# EAGLE design schalterbox_01 (EAGLE 5.12)
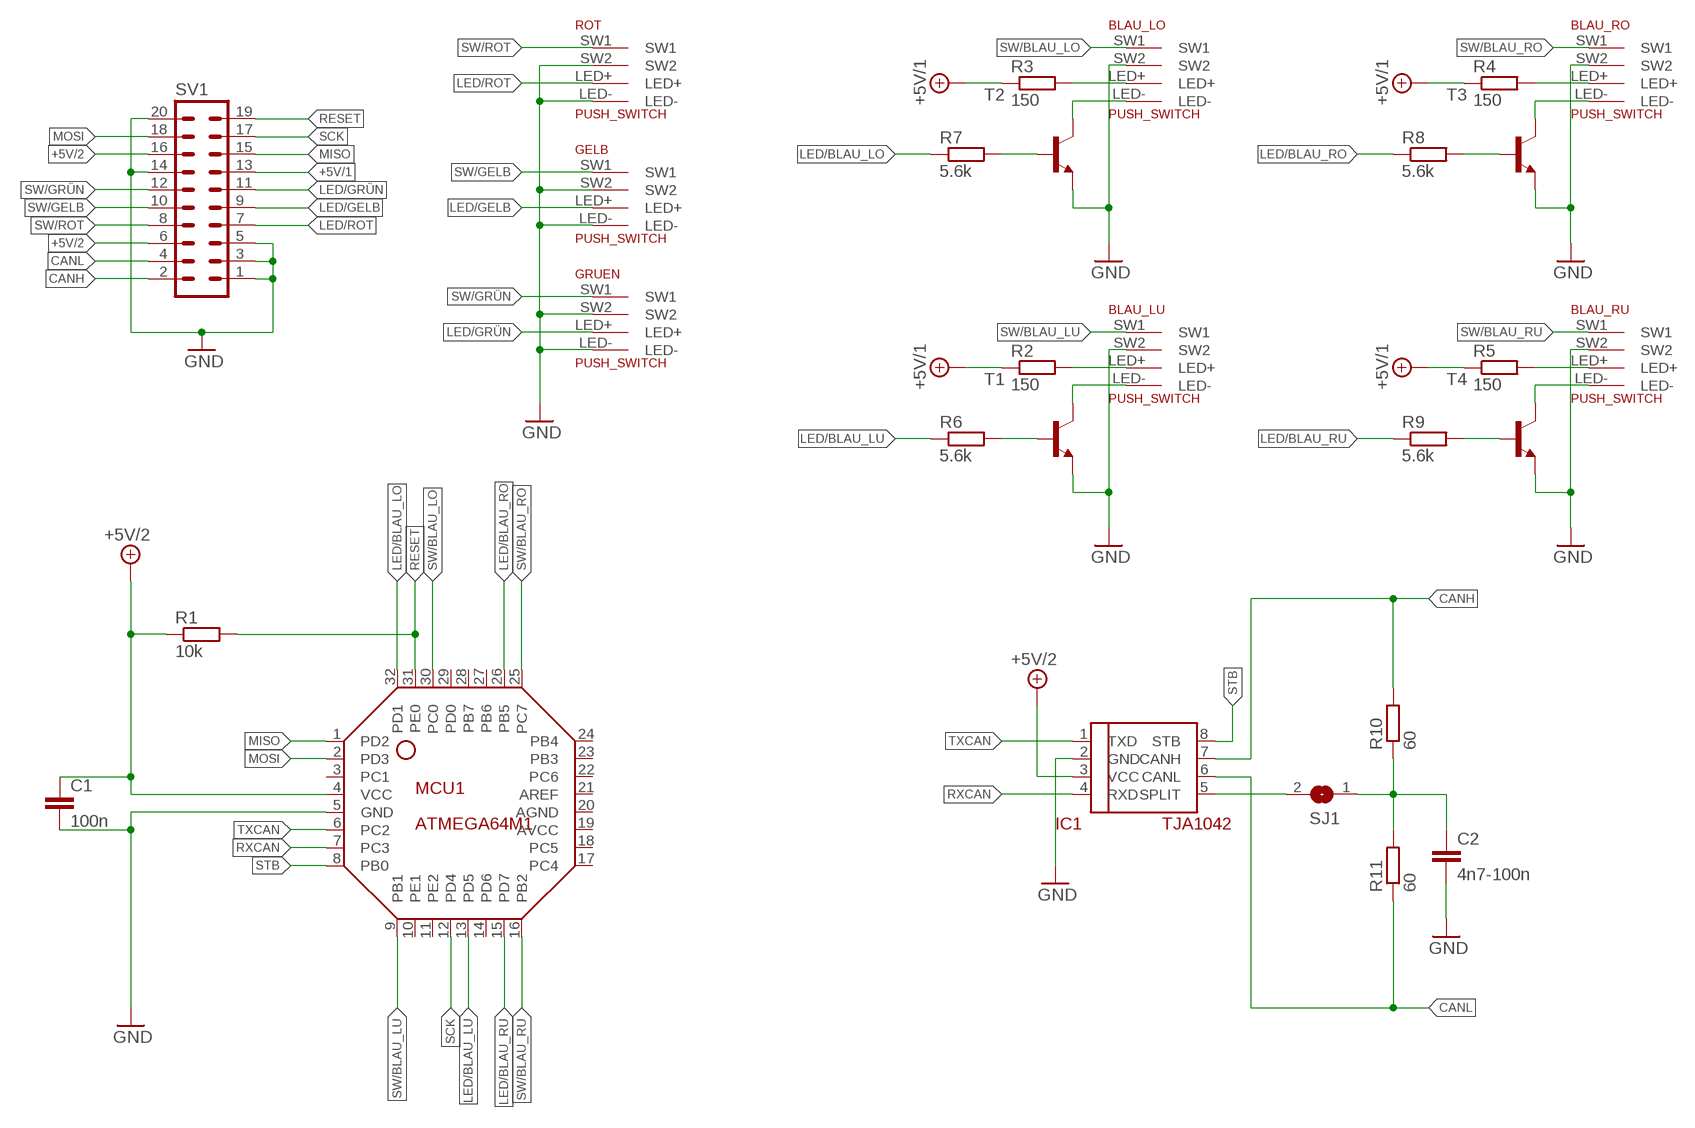
[diagram p0: schematic, sheet 1]

## Parts
BLAU_LO  PUSH_SWITCH  [PUSH_SWITCH]
BLAU_LU  PUSH_SWITCH  [PUSH_SWITCH]
BLAU_RO  PUSH_SWITCH  [PUSH_SWITCH]
BLAU_RU  PUSH_SWITCH  [PUSH_SWITCH]
C1  100n  C-EUC0603  [C0603]
C2  4n7-100n  C-EUC0603  [C0603]
GELB  PUSH_SWITCH  [PUSH_SWITCH]
GRUEN  PUSH_SWITCH  [PUSH_SWITCH]
IC1  TJA1042  [SO08]
MCU1  ATMEGA64M1  [TQFP-32]
R1  10k  R-EU_R0805  [R0805]
R2  150  R-EU_R0805  [R0805]
R3  150  R-EU_R0805  [R0805]
R4  150  R-EU_R0805  [R0805]
R5  150  R-EU_R0805  [R0805]
R6  5.6k  R-EU_R0805  [R0805]
R7  5.6k  R-EU_R0805  [R0805]
R8  5.6k  R-EU_R0805  [R0805]
R9  5.6k  R-EU_R0805  [R0805]
R10  60  R-EU_R0805  [R0805]
R11  60  R-EU_R0805  [R0805]
ROT  PUSH_SWITCH  [PUSH_SWITCH]
SJ1  SJ  [SJ]
SV1  ML20L  [ML20L]
T1  BC817-40-NPN-SOT23-BEC  [SOT23-BEC]
T2  BC817-40-NPN-SOT23-BEC  [SOT23-BEC]
T3  BC817-40-NPN-SOT23-BEC  [SOT23-BEC]
T4  BC817-40-NPN-SOT23-BEC  [SOT23-BEC]

## Nets
+5V/1: R2.1 R3.1 R4.1 R5.1 SV1.13
+5V/2: C1.1 IC1.3(VCC) MCU1.4(VCC) R1.1 SV1.6 SV1.16
CANH: IC1.7(CANH) R10.2 SV1.2
CANL: IC1.6(CANL) R11.1 SV1.4
GND: BLAU_LO.SW2 BLAU_LU.SW2 BLAU_RO.SW2 BLAU_RU.SW2 C1.2 C2.2 GELB.LED- GELB.SW2 GRUEN.LED- GRUEN.SW2 IC1.2(GND) MCU1.5(GND) ROT.LED- ROT.SW2 SV1.1 SV1.3 SV1.5 SV1.14 SV1.20 T1.E T2.E T3.E T4.E
LED/BLAU_LO: MCU1.32(PD1) R7.1
LED/BLAU_LU: MCU1.13(PD5) R6.1
LED/BLAU_RO: MCU1.26(PB5) R8.1
LED/BLAU_RU: MCU1.15(PD7) R9.1
LED/GELB: GELB.LED+ SV1.9
LED/GRÜN: GRUEN.LED+ SV1.11
LED/ROT: ROT.LED+ SV1.7
MISO: MCU1.1(PD2) SV1.15
MOSI: MCU1.2(PD3) SV1.18
N$1: C2.1 R10.1 R11.2 SJ1.1
N$2: IC1.5(SPLIT) SJ1.2
N$3: BLAU_LO.LED+ R3.2
N$4: BLAU_LO.LED- T2.C
N$7: BLAU_LU.LED+ R2.2
N$8: BLAU_LU.LED- T1.C
N$11: BLAU_RU.LED+ R5.2
N$13: BLAU_RU.LED- T4.C
N$17: BLAU_RO.LED+ R4.2
N$18: BLAU_RO.LED- T3.C
N$22: R6.2 T1.B
N$23: R9.2 T4.B
N$24: R8.2 T3.B
N$25: R7.2 T2.B
RESET: MCU1.31(PE0) R1.2 SV1.19
RXCAN: IC1.4(RXD) MCU1.7(PC3)
SCK: MCU1.12(PD4) SV1.17
STB: IC1.8(STB) MCU1.8(PB0)
SW/BLAU_LO: BLAU_LO.SW1 MCU1.30(PC0)
SW/BLAU_LU: BLAU_LU.SW1 MCU1.9(PB1)
SW/BLAU_RO: BLAU_RO.SW1 MCU1.25(PC7)
SW/BLAU_RU: BLAU_RU.SW1 MCU1.16(PB2)
SW/GELB: GELB.SW1 SV1.10
SW/GRÜN: GRUEN.SW1 SV1.12
SW/ROT: ROT.SW1 SV1.8
TXCAN: IC1.1(TXD) MCU1.6(PC2)
Unconnected: MCU1.3(PC1) MCU1.10(PE1) MCU1.11(PE2) MCU1.14(PD6) MCU1.17(PC4) MCU1.18(PC5) MCU1.19(AVCC) MCU1.20(AGND) MCU1.21(AREF) MCU1.22(PC6) MCU1.23(PB3) MCU1.24(PB4) MCU1.27(PB6) MCU1.28(PB7) MCU1.29(PD0)

## Library data of the parts
BLAU_LO BLAU_LU BLAU_RO BLAU_RU GELB GRUEN ROT = ownParts:PUSH_SWITCH
C1 C2 = rcl:C-EU: CAPACITOR, European symbol
IC1 = ownParts:TJA1042
MCU1 = ownParts:ATMEGA64M1
R1-R11 = resistor:R-EU_: RESISTOR, European symbol
SJ1 = jumper:SJ: SMD solder JUMPER
SV1 = con-ml:ML20L: HARTING; OC_FARNELL: unknown; OC_NEWARK: unknown
T1-T4 = transistor:*-NPN-: NPN Transistror BF959 corrected 2008.03.06

## Board
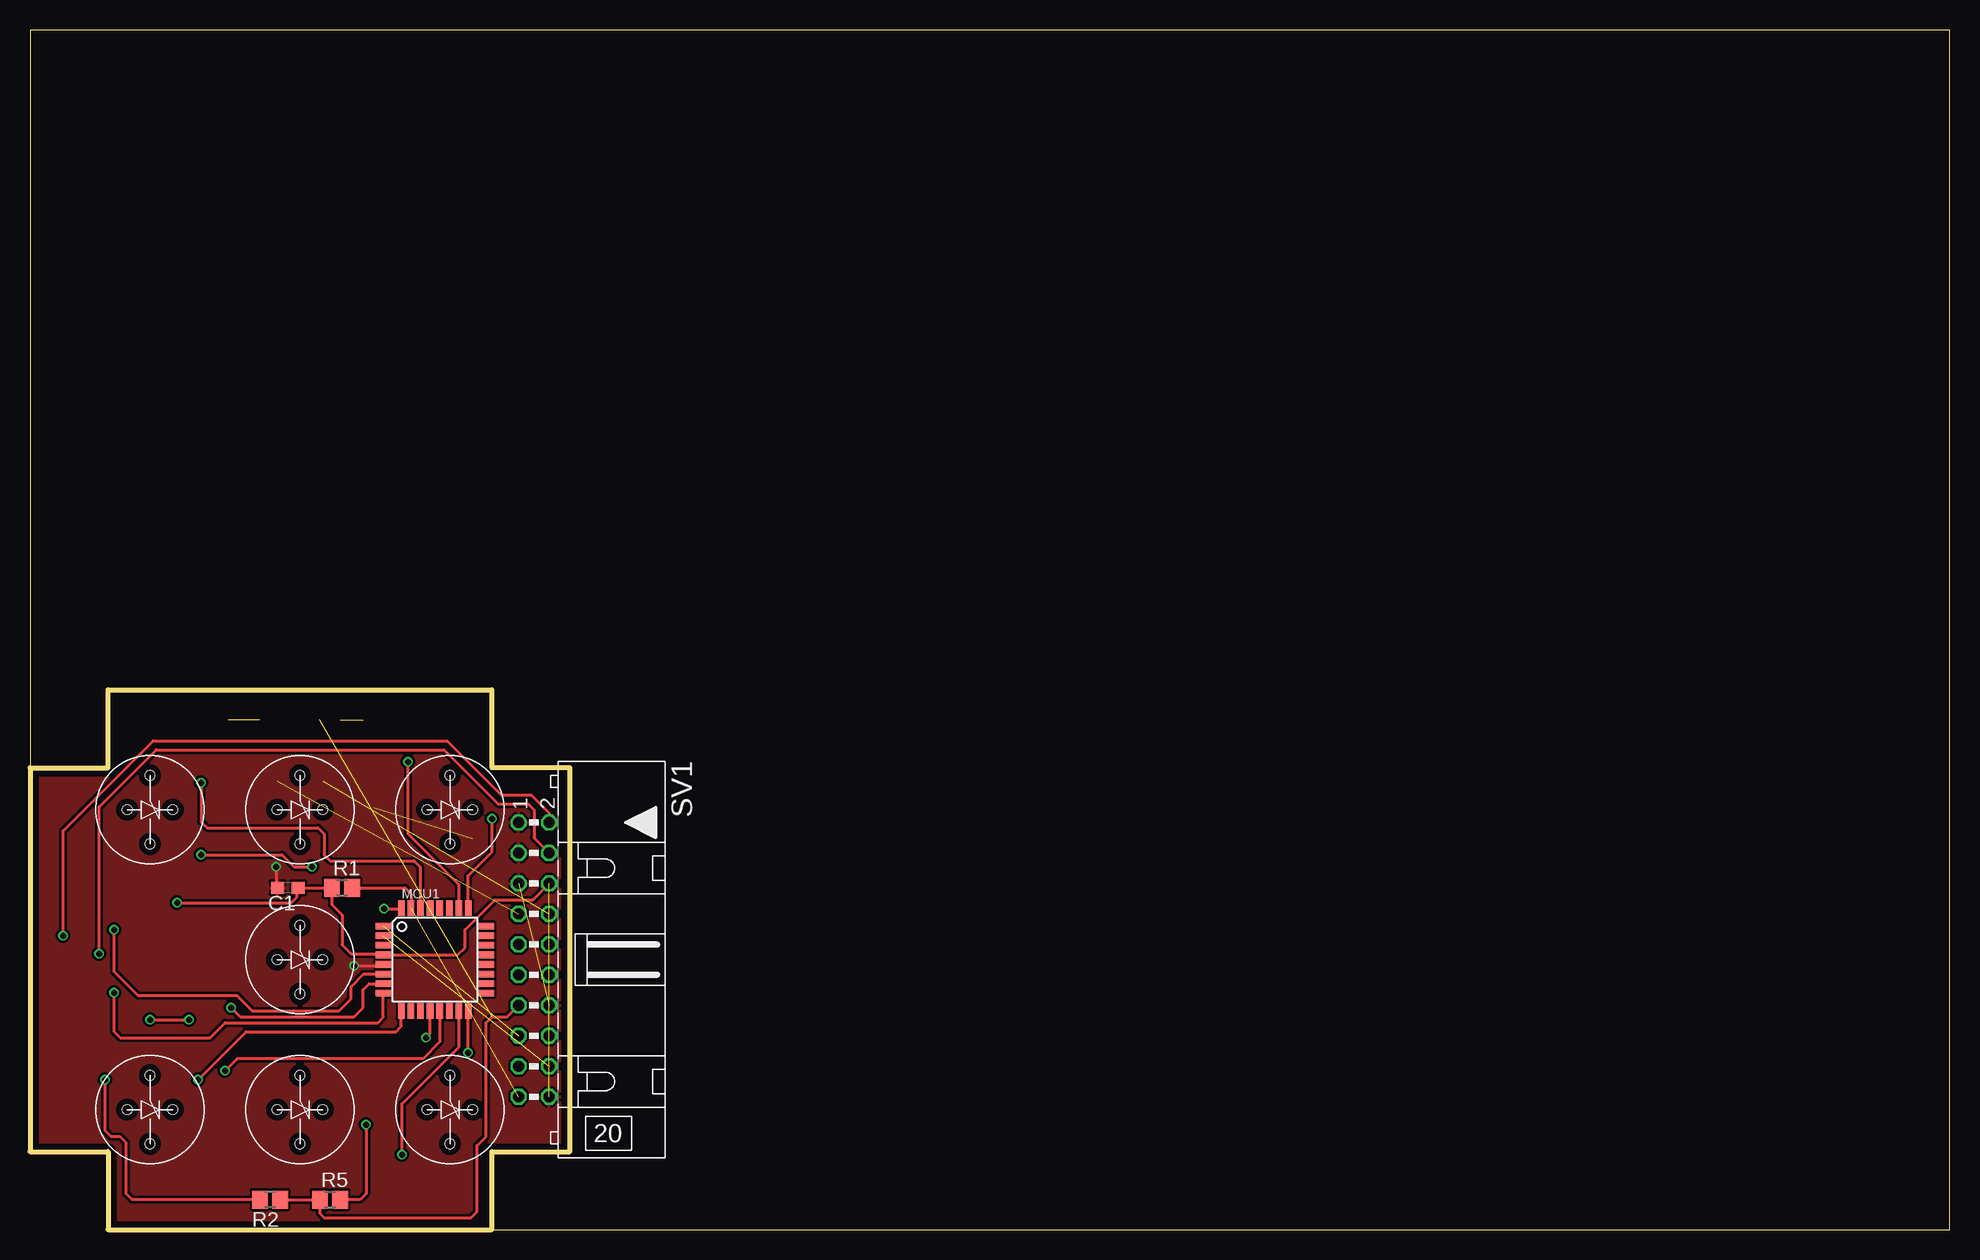
[diagram p1: board, top side]
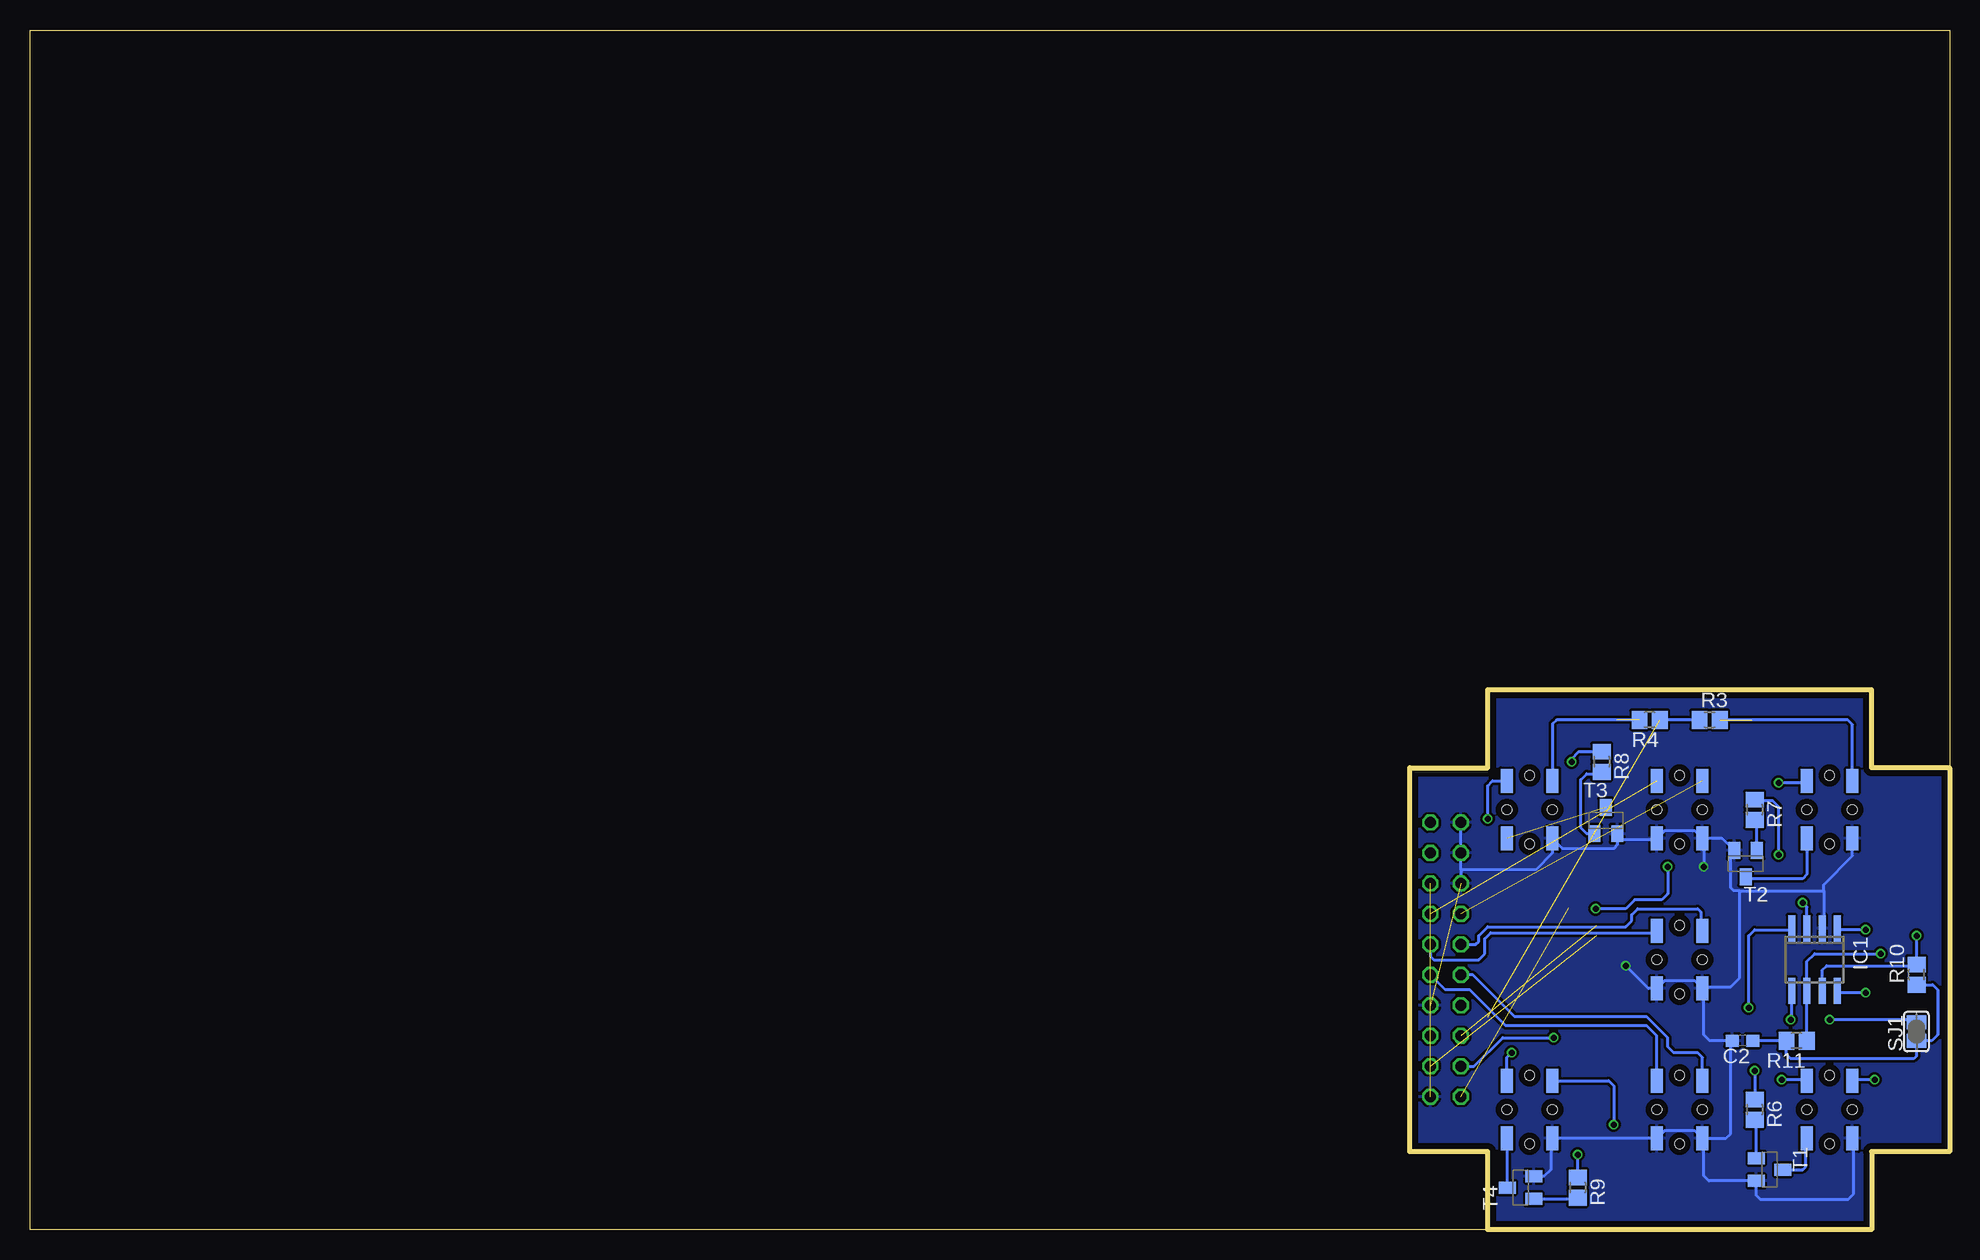
[diagram p2: board, bottom side, seen from below]

Size 160 x 100 mm. Coordinates in mm from the lower left corner, seen from the top.
Outline: 38.5,0 160,0 160,100 0,100 0,38.5
Outline: 0,38.5 0,6.5 6.5,6.5 6.5,0 38.5,0
Outline: 0,38.5 6.5,38.5 6.5,45 38.5,45 38.5,38.5 45,38.5 45,6.5 38.5,6.5 38.5,0
Copper layers (1*16): Top 0.07mm / dielectric 1.5mm / Bottom 0.07mm
Design rules "multi-cb_070um-cu": minimum track width 8mil, minimum drill 12mil, track to track 8mil, track to pad 8mil, pad to pad 8mil, via to via 8mil, smd to smd 8mil, copper to edge 20mil, drill to drill 8mil, minimum pad ring 8mil, minimum via ring 6mil, stop-mask expansion 3mil, vias tented up to drill 0mil, thermal gap 8mil

### Footprints (pad centres in the part's own frame; a part is rotated, then mirrored left to right if it is on the bottom)
PUSH_SWITCH = smd 1 x 2 bottom: LED+ -1.9,2.4; LED- 1.9,-2.4; SW1 1.9,2.4; SW2 -1.9,-2.4 | hole 0.8: 0,2.85; 0,-2.85; -1.9,0; 1.9,0
C0603 = smd 1.1 x 1: 1 -0.85,0; 2 0.85,0
SO08 = smd 0.6 x 2.2: 1 -1.905,-2.6; 2 -0.635,-2.6; 3 0.635,-2.6; 4 1.905,-2.6; 5 1.905,2.6; 6 0.635,2.6; 7 -0.635,2.6; 8 -1.905,2.6
TQFP-32 = smd 1.27 x 0.559: 1 -4.293,2.8; 2 -4.293,2; 3 -4.293,1.2; 4 -4.293,0.4; 5 -4.293,-0.4; 6 -4.293,-1.2; 7 -4.293,-2; 8 -4.293,-2.8; 17 4.293,-2.8; 18 4.293,-2; 19 4.293,-1.2; 20 4.293,-0.4; 21 4.293,0.4; 22 4.293,1.2; 23 4.293,2; 24 4.293,2.8 | smd 0.559 x 1.27: 9 -2.8,-4.293; 10 -2,-4.293; 11 -1.2,-4.293; 12 -0.4,-4.293; 13 0.4,-4.293; 14 1.2,-4.293; 15 2,-4.293; 16 2.8,-4.293; 25 2.8,4.293; 26 2,4.293; 27 1.2,4.293; 28 0.4,4.293; 29 -0.4,4.293; 30 -1.2,4.293; 31 -2,4.293; 32 -2.8,4.293
R0805 = smd 1.3 x 1.5: 1 -0.85,0; 2 0.85,0
SJ = smd 1.168 x 1.6: 1 -0.762,0; 2 0.762,0
ML20L = drill 0.914 octagon: 1 -11.43,-1.27; 2 -11.43,1.27; 3 -8.89,-1.27; 4 -8.89,1.27; 5 -6.35,-1.27; 6 -6.35,1.27; 7 -3.81,-1.27; 8 -3.81,1.27; 9 -1.27,-1.27; 10 -1.27,1.27; 11 1.27,-1.27; 12 1.27,1.27; 13 3.81,-1.27; 14 3.81,1.27; 15 6.35,-1.27; 16 6.35,1.27; 17 8.89,-1.27; 18 8.89,1.27; 19 11.43,-1.27; 20 11.43,1.27
SOT23-BEC = smd 1 x 1.4: B -0.95,-1.1; C 0,1.1; E 0.95,-1.1

### Placement (x,y rotation side)
BLAU_LO  10,35 0 top
BLAU_LU  10,10 0 top
BLAU_RO  35,35 0 top
BLAU_RU  35,10 0 top
C1  21.5,28.5 180 top
C2  17.25,15.75 180 bottom
GELB  22.5,22.5 0 top
GRUEN  22.5,10 0 top
IC1  11.25,22.5 180 bottom
MCU1  33.75,22.5 0 top
R1  26,28.5 0 top
R2  20,2.5 180 top
R3  20,42.5 0 bottom
R4  25,42.5 180 bottom
R5  25,2.5 0 top
R6  16.25,10 270 bottom
R7  16.25,35 270 bottom
R8  29,39 270 bottom
R9  31,3.5 270 bottom
R10  2.75,21.25 90 bottom
R11  12.75,15.75 180 bottom
ROT  22.5,35 0 top
SJ1  2.75,16.5 90 bottom
SV1  42,22.5 270 top
T1  15,5 270 bottom
T2  17,30.5 180 bottom
T3  28.65,34.1 0 bottom
T4  35.75,3.5 90 bottom

### Tracks (layer width: path | path; a pad name or v marks a point on that pad's centre or on a via)
+5V/1  (1 unrouted)
  Top 0.254: R2.1 R5.1 24.15,1.35 24.5,1 36.75,1 37.25,1.5 37.25,7 38,7.75 38,17.25 38.5,17.75 39.79,17.75 SV1.13
  Bottom 0.254: R3.1 R4.1
+5V/2  (via drill 0.5)  (1 unrouted)
  Top 0.254: v12.25,27.25 21.75,27.25 22.25,27.75 22.25,28.4 C1.1 R1.1 25.15,27.1 26,26.25 26,23.75 26.75,23 29.36,23 MCU1.4 35.65,22.9 36.25,23.5 36.25,25 38.75,27.5 41.92,27.5 SV1.6
  Bottom 0.254: IC1.3 11.88,26.89 v12.25,27.25
CANH  (via drill 0.5)
  Top 0.254: SV1.2 43.27,34.73 41.75,36.25 39.25,36.25 34.75,40.75 10.25,40.75 2.75,33.25 v2.75,24.5
  Bottom 0.254: v2.75,24.5 R10.2 2.85,22 10.25,22 10.62,21.64 IC1.7
CANL  (via drill 0.5)
  Top 0.254: v5.75,23 5.75,35.25 10.5,40 34.5,40 39,35.5 41.5,35.5 42,35 42,32.66 SV1.4
  Bottom 0.254: R11.1 11.9,19.89 IC1.6 11.88,22.36 11.25,23 v5.75,23
GND  (via drill 0.5)  (2 unrouted)
  Top 0.254: v20.5,30.25 20.5,28.65 C1.2 | MCU1.5 29.36,22 v27,22
  Bottom 0.254: BLAU_LO.SW2 8.1,31.15 10.5,28.75 10.5,28.25 | 10.5,28.25 10.5,25.21 IC1.2 | T4.E 33.8,4.45 33.25,5 33.25,7.45 BLAU_RU.SW2 GRUEN.LED- 23.75,8.25 21.25,8.25 GRUEN.SW2 | GRUEN.SW2 20.5,7.5 20.5,4.5 20.05,4.05 T1.E 16.1,2.85 15.75,2.5 8.5,2.5 8,3 8,7.5 BLAU_LU.SW2 | GELB.SW2 21.25,20.75 23.75,20.75 GELB.LED- 25.1,20.1 v27,22 | ROT.SW2 21.25,33.25 23.75,33.25 ROT.LED- 24.5,32.5 27.7,32.5 T3.E 27.7,32.05 28,31.75 32.25,31.75 BLAU_RO.SW2 33.1,31.4 34.5,30 40.73,30 | ROT.SW2 18.95,32.6 T2.E 18.25,31.3 18.25,28.5 18,28.25 17.5,28.25 | GRUEN.SW2 18.65,7.6 18.25,8 18.25,15.6 C2.2 20,15.75 20.5,16.25 20.5,20 GELB.SW2 | ROT.SW2 20.5,32.5 v20.5,30.25 | GELB.SW2 20.45,20.25 18.25,20.25 17.5,21 17.5,28.25 | 17.5,28.25 10.5,28.25 | SV1.1 SV1.3 40.73,30 | 40.73,30 SV1.5
  pour Top: 0,45 45,45 45,0 0,0
  pour Bottom: 0,45 45,45 45,0 0,0
LED/BLAU_LO  (via drill 0.5)
  Top 0.254: MCU1.32 30.91,26.75 v29.5,26.75 | v23.5,30.25 22,30.25 21,31.25 v14.25,31.25
  Bottom 0.254: v29.5,26.75 27,26.75 26.25,27.5 24,27.5 23.5,28 v23.5,30.25 | v14.25,31.25 14.25,35.25 14.75,35.75 16.15,35.75 R7.1
LED/BLAU_LU  (via drill 0.5)
  Top 0.254: MCU1.13 34.15,15.65 32.75,14.25 17.25,14.25 v16.25,13.25
  Bottom 0.254: v16.25,13.25 R6.1
LED/BLAU_RO  (via drill 0.5)
  Top 0.254: v31.5,39 31.5,33 35.75,28.75 MCU1.26
  Bottom 0.254: R8.1 30.9,39.85 31.5,39.25 v31.5,39
LED/BLAU_RU  (via drill 0.5)
  Top 0.254: v31,6.25 31,10.5 35.75,15.25 MCU1.15
  Bottom 0.254: R9.1 v31,6.25
LED/GELB
  Bottom 0.254: SV1.9 39.48,23.77 39.25,24 39.25,24.5 38.5,25.25 27,25.25 26.5,25.75 26.5,26.25 26,26.75 21,26.75 20.75,26.5 20.75,25.05 GELB.LED+
LED/GRÜN
  Bottom 0.254: GRUEN.LED+ 20.6,14.35 21,14.75 23,14.75 23.5,15.25 23.5,16 25.25,17.75 36.25,17.75 39.75,21.25 40.71,21.25 SV1.11
LED/ROT  (1 unrouted)
MISO  (1 unrouted)
MOSI  (1 unrouted)
N$1
  Bottom 0.254: C2.1 R11.2 13.6,14.6 13.25,14.25 3,14.25 2.75,14.5 SJ1.1 2.74,15.75 1.5,15.75 1,16.25 1,20 1.4,20.4 R10.1
N$2  (via drill 0.5)
  Top 0.254: v10,17.5 v13.25,17.5
  Bottom 0.254: SJ1.2 2.99,17.5 v10,17.5 | v13.25,17.5 13.15,17.59 IC1.5
N$3  (2 unrouted)
  Bottom 0.254: BLAU_LO.LED+ 8.1,42.1 8.5,42.5 R3.2
N$4
  Bottom 0.254: BLAU_LO.LED- 11.9,29.6 12.25,29.25 16.85,29.25 T2.C
N$7  (via drill 0.5)
  Top 0.254: R2.2 8.5,2.5 8,3 8,7.25 7.5,7.75 6.75,7.75 6.25,8.25 v6.25,12.5
  Bottom 0.254: v6.25,12.5 8,12.5 BLAU_LU.LED+
N$8
  Bottom 0.254: T1.C 12.25,5 12,5.25 12,7.5 BLAU_LU.LED-
N$11  (via drill 0.5)
  Top 0.254: v28,8.75 28,3 27.5,2.5 R5.2
  Bottom 0.254: BLAU_RU.LED+ 28.4,12.4 28,12 v28,8.75
N$13
  Bottom 0.254: T4.C 36.85,7.55 BLAU_RU.LED-
N$17  (2 unrouted)
  Bottom 0.254: BLAU_RO.LED+ 33.1,42.15 32.75,42.5 R4.2
N$18  (1 unrouted)
N$22
  Bottom 0.254: T1.B 16.1,9 R6.2
N$23
  Bottom 0.254: T4.B 31.1,2.55 R9.2
N$24
  Bottom 0.254: T3.B 30.25,33 30.75,33.5 30.75,37.5 30.25,38 29.15,38 R8.2
N$25
  Bottom 0.254: T2.B 16.05,33.95 R7.2
RESET  (1 unrouted)
  Top 0.254: R1.2 31.25,28.5 31.75,28 MCU1.31
RXCAN  (via drill 0.5)
  Top 0.254: MCU1.7 28.25,20.5 27.75,20 27.75,18.5 27,17.75 17.5,17.75 v16.75,18.5
  Bottom 0.254: v16.75,18.5 16.75,24.5 16.25,25 13.26,25 IC1.4
SCK  (via drill 0.5)
  Top 0.254: v33,16 33.35,16.35 MCU1.12
  Bottom 0.254: SV1.17 39.64,13.61 37.25,16 v33,16
STB  (via drill 0.5)
  Top 0.254: MCU1.8 29.46,17.71 29,17.25 16.25,17.25 15,16 7.5,16 7,16.5 v7,19.75
  Bottom 0.254: v7,19.75 9.2,19.75 IC1.8
SW/BLAU_LO  (via drill 0.5)
  Top 0.254: MCU1.30 32.5,26.84 32.5,30.25 32,30.75 25,30.75 24.5,31.25 24.5,33 24,33.5 14.75,33.5 14.25,34 v14.25,37.25
  Bottom 0.254: v14.25,37.25 12.05,37.25 BLAU_LO.SW1
SW/BLAU_LU  (via drill 0.5)
  Top 0.254: MCU1.9 30.95,16.95 30.5,16.5 18,16.5 v14,12.5
  Bottom 0.254: v14,12.5 12,12.5 BLAU_LU.SW1
SW/BLAU_RO  (via drill 0.5)
  Top 0.254: MCU1.25 36.5,26.84 36.5,29.5 38.5,31.5 v38.5,34.25
  Bottom 0.254: BLAU_RO.SW1 38.1,37.4 38.5,37 v38.5,34.25
SW/BLAU_RU  (via drill 0.5)
  Top 0.254: v36.5,14.75 36.5,18.16 MCU1.16
  Bottom 0.254: BLAU_RU.SW1 36.9,14.35 v36.5,14.75
SW/GELB
  Bottom 0.254: SV1.10 43.27,22.77 43,22.5 39.25,22.5 38.75,23 38.75,24.25 38.25,24.75 24.55,24.75 GELB.SW1
SW/GRÜN
  Bottom 0.254: GRUEN.SW1 24.4,16.15 25.25,17 37,17 40,20 42.04,20 SV1.12
SW/ROT  (1 unrouted)
TXCAN  (via drill 0.5)
  Top 0.254: MCU1.6 27.8,21.3 26.75,20.25 26.75,19.25 25.75,18.25 18.5,18.25 17.25,19.5 9,19.5 7,21.5 v7,25
  Bottom 0.254: v7,25 9.24,25 IC1.1